# Altium schematic sheet Human_Interface.SchDoc
size A4
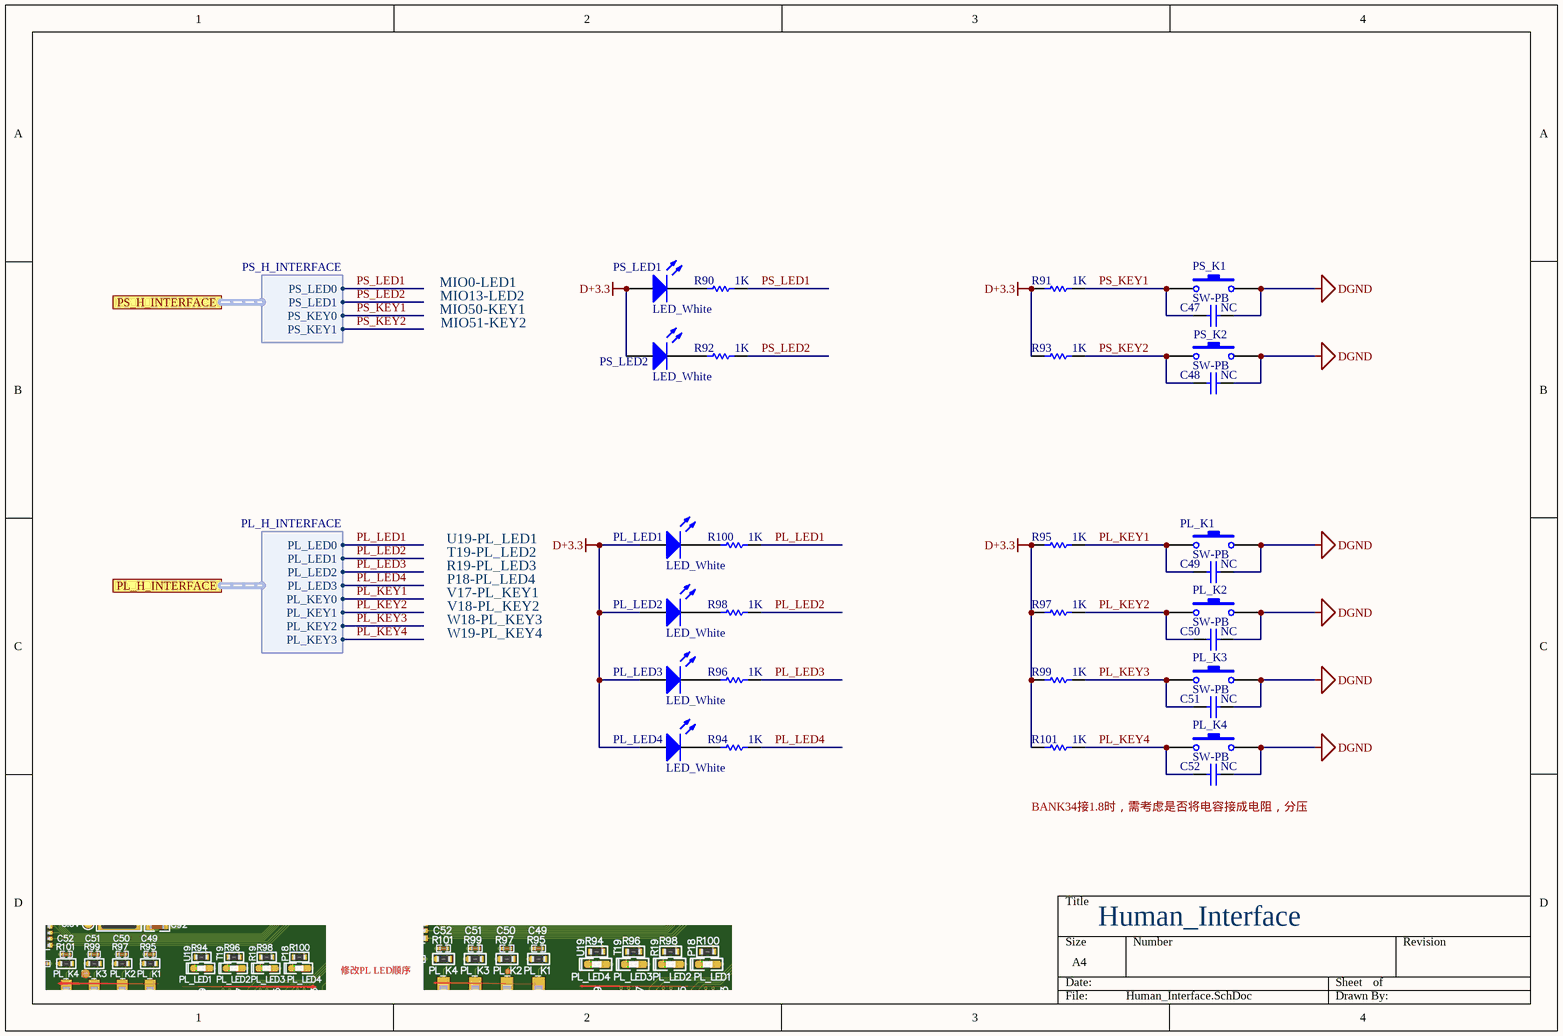
[diagram p0: Human_Interface.SchDoc]

## Parts
C47  NC  [C 0402_LL]
C48  NC  [C 0402_LL]
C49  NC  [C 0402_LL]
C50  NC  [C 0402_LL]
C51  NC  [C 0402_LL]
C52  NC  [C 0402_LL]
PL_K1  SW-PB  [TSW SMD-3*6*4.3]
PL_K2  SW-PB  [TSW SMD-3*6*4.3]
PL_K3  SW-PB  [TSW SMD-3*6*4.3]
PL_K4  SW-PB  [TSW SMD-3*6*4.3]
PL_LED1  LED_White  [LED 0603W]
PL_LED2  LED_White  [LED 0603W]
PL_LED3  LED_White  [LED 0603W]
PL_LED4  LED_White  [LED 0603W]
PS_K1  SW-PB  [TSW SMD-3*6*4.3]
PS_K2  SW-PB  [TSW SMD-3*6*4.3]
PS_LED1  LED_White  [LED 0603W]
PS_LED2  LED_White  [LED 0603W]
R90  1K  [R 0603_L]
R91  1K  [R 0603_L]
R92  1K  [R 0603_L]
R93  1K  [R 0603_L]
R94  1K  [R 0603_L]
R95  1K  [R 0603_L]
R96  1K  [R 0603_L]
R97  1K  [R 0603_L]
R98  1K  [R 0603_L]
R99  1K  [R 0603_L]
R100  1K  [R 0603_L]
R101  1K  [R 0603_L]

## Ports
PL_H_INTERFACE (harness PL_H_INTERFACE), PS_H_INTERFACE (harness PS_H_INTERFACE)

## Harnesses
PS_H_INTERFACE: PS_LED0, PS_LED1, PS_KEY0, PS_KEY1
PL_H_INTERFACE: PL_LED0, PL_LED1, PL_KEY0, PL_KEY1, PL_LED2, PL_LED3, PL_KEY2, PL_KEY3

## Nets
D+3.3: PL_LED1.1(A) PL_LED2.1(A) PL_LED3.1(A) PL_LED4.1(A) PS_LED1.1(A) PS_LED2.1(A) R91.2 R93.2 R95.2 R97.2 R99.2 R101.2
DGND: C47.1 C48.1 C49.1 C50.1 C51.1 C52.1 PL_K1.2 PL_K2.2 PL_K3.2 PL_K4.2 PS_K1.2 PS_K2.2
PL_KEY1: C49.2 PL_K1.1 R95.1 ; port PL_H_INTERFACE.PL_KEY0
PL_KEY2: C50.2 PL_K2.1 R97.1 ; port PL_H_INTERFACE.PL_KEY1
PL_KEY3: C51.2 PL_K3.1 R99.1 ; port PL_H_INTERFACE.PL_KEY2
PL_KEY4: C52.2 PL_K4.1 R101.1 ; port PL_H_INTERFACE.PL_KEY3
PL_LED1: R100.1 ; port PL_H_INTERFACE.PL_LED0
PL_LED2: R98.1 ; port PL_H_INTERFACE.PL_LED1
PL_LED3: R96.1 ; port PL_H_INTERFACE.PL_LED2
PL_LED4: R94.1 ; port PL_H_INTERFACE.PL_LED3
PS_KEY1: C47.2 PS_K1.1 R91.1 ; port PS_H_INTERFACE.PS_KEY0
PS_KEY2: C48.2 PS_K2.1 R93.1 ; port PS_H_INTERFACE.PS_KEY1
PS_LED1: R90.1 ; port PS_H_INTERFACE.PS_LED0
PS_LED2: R92.1 ; port PS_H_INTERFACE.PS_LED1
NetPL_LED1_2: PL_LED1.2(K) R100.2
NetPL_LED2_2: PL_LED2.2(K) R98.2
NetPL_LED3_2: PL_LED3.2(K) R96.2
NetPL_LED4_2: PL_LED4.2(K) R94.2
NetPS_LED1_2: PS_LED1.2(K) R90.2
NetPS_LED2_2: PS_LED2.2(K) R92.2

## Notes on the sheet
- MIO0-LED1
- MIO13-LED2
- MIO50-KEY1
- MIO51-KEY2
- P18-PL_LED4
- T19-PL_LED2
- R19-PL_LED3
- U19-PL_LED1
- V17-PL_KEY1
- V18-PL_KEY2
- W18-PL_KEY3
- W19-PL_KEY4
- (near C52) BANK34接1.8时，需考虑是否将电容接成电阻，分压
- Human_Interface
- 修改PL LED顺序

## Library data of the parts
C47-C52 = Cap: Capacitor; Published: 8-Jun-2000; LatestRevisionDate: 17-Jul-2002; LatestRevisionNote: Re-released for DXP Platform.; PackageReference: RAD-0.3; Publisher: Altium Limited; PackageDescription: Radial Cap, Thru-Hole; 2 Leads; 0.3 in Pin Spacing
PL_K1-PL_K4 PS_K1 PS_K2 = SW-PB: Switch; Published: 24-Mar-1999; LatestRevisionDate: 17-Jul-2002; LatestRevisionNote: Re-released for DXP Platform.; PackageReference: SPST-2; Publisher: Altium Limited; PackageDescription: Switch; 2 Leads
PL_LED1-PL_LED4 PS_LED1 PS_LED2 = LED0: Typical INFRARED GaAs LED; Published: 8-Jun-2000; LatestRevisionDate: 08-Jul-2005; LatestRevisionNote: Mech Layer 1 removed.; PackageReference: LED-0; Publisher: Altium Limited; PackageDescription: LED; 2 Leads
R90-R101 = Res1: Resistor; Published: 8-Jun-2000; LatestRevisionDate: 17-Jul-2002; LatestRevisionNote: Re-released for DXP Platform.; PackageReference: AXIAL-0.3; Publisher: Altium Limited; PackageDescription: Axial Device, Thru-Hole; 2 Leads; 0.3 in Pin Spacing; Value: 1K